# Altium project FrequencyMeter.PrjPcb
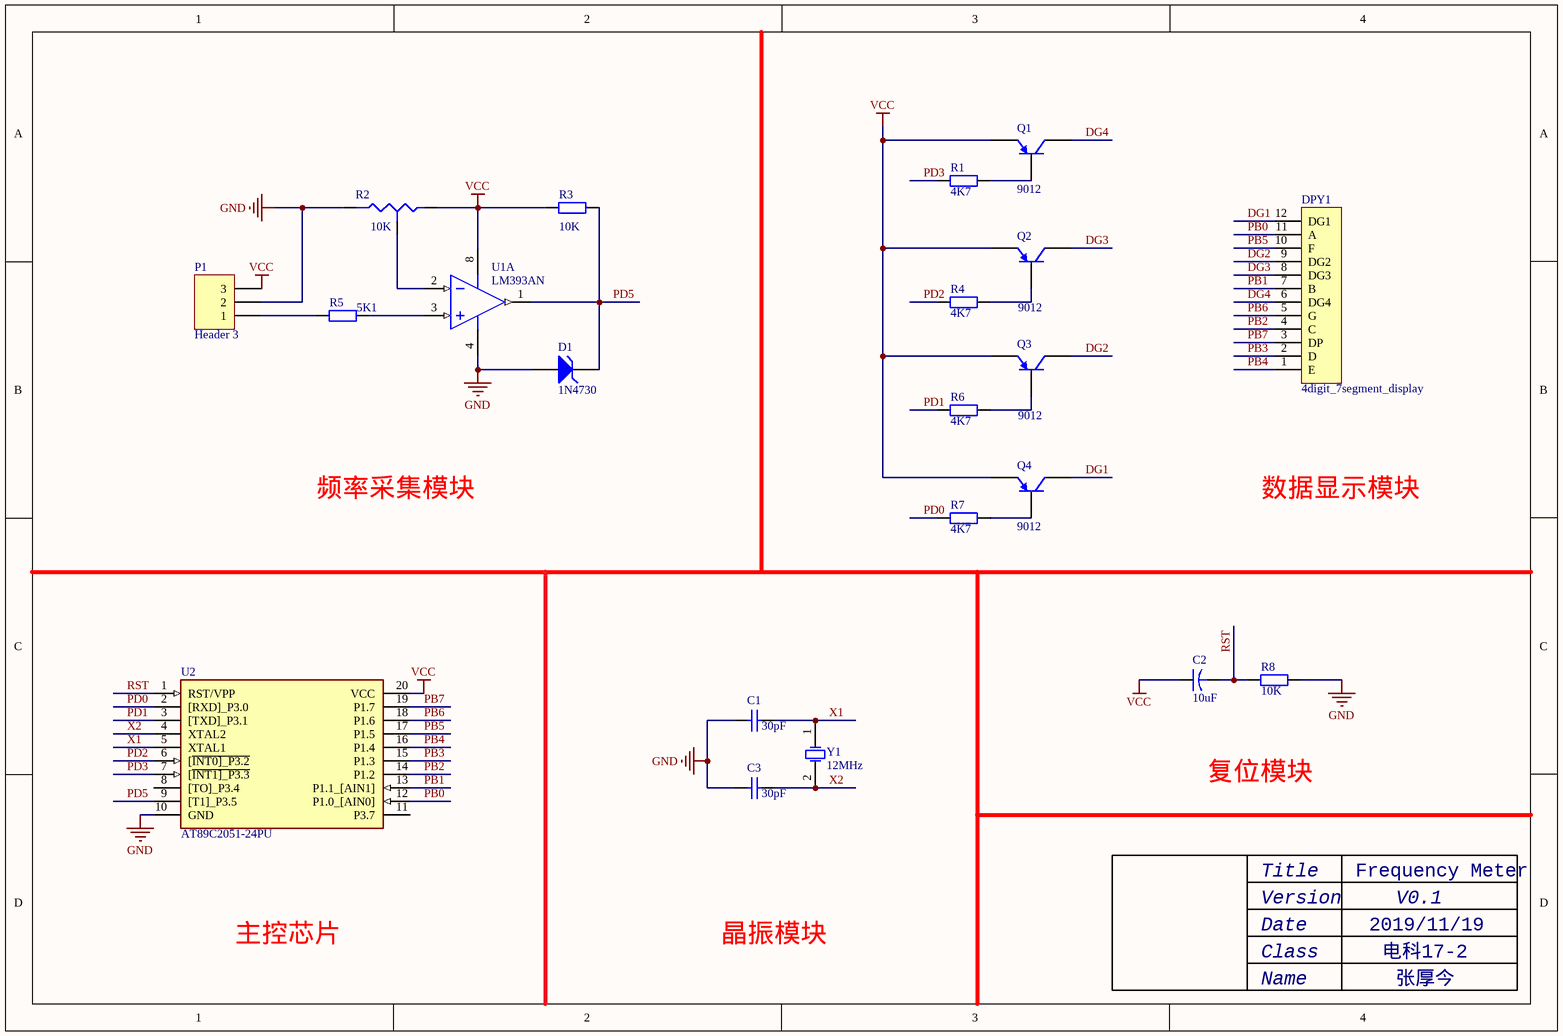
[diagram p0: FrequencyMeter.SchDoc]
1 sheet, 21 parts. Net scope: global (net labels, ports and power ports of the same name join across sheets).
Board file: FrequencyMeter.PcbDoc

## Sheet FrequencyMeter.SchDoc: Frequency Meter
size A4; Date: 2019/11/19; DrawnBy: 张厚今; Revision: V0.1; 班级: 电科17-2

### Parts
C1  value 30pF  [RAD-0.1]  (hidden comment: Cap)
C2  value 10uF  [CAPR5-4X5]  (hidden comment: Cap2)
C3  value 30pF  [RAD-0.1]  (hidden comment: Cap)
D1  1N4730  [DIODE-0.4]
DPY1  4digit_7segment_display  [4digit_7segment_display]
P1  Header 3  [HDR1X3]
Q1  9012  [TO-226-AA]
Q2  9012  [TO-226-AA]
Q3  9012  [TO-226-AA]
Q4  9012  [TO-226-AA]
R1  value 4K7  [AXIAL-0.4]  (hidden comment: Res2)
R2  value 10K  [VR5]  (hidden comment: Res Tap)
R3  value 10K  [AXIAL-0.4]  (hidden comment: Res2)
R4  value 4K7  [AXIAL-0.4]  (hidden comment: Res2)
R5  value 5K1  [AXIAL-0.4]  (hidden comment: Res2)
R6  value 4K7  [AXIAL-0.4]  (hidden comment: Res2)
R7  value 4K7  [AXIAL-0.4]  (hidden comment: Res2)
R8  value 10K  [AXIAL-0.4]  (hidden comment: Res2)
U1  LM393AN  [626-05]  (part A of 2)
U2  AT89C2051-24PU  [DIP794W56P254L2591H533Q20N]
Y1  12MHz  [R38]

### Nets
GND: C1.2 C3.2 D1.1(A) P1.2 R2.2(B) R8.1 U1.4(GND) U2.10(GND)
VCC: C2.1 P1.3 Q1.3(E) Q2.3(E) Q3.3(E) Q4.3(E) R2.1(A) R3.1 U1.8(V+) U2.20(VCC)
DG1: DPY1.12(DG1) Q4.1(C)
DG2: DPY1.9(DG2) Q3.1(C)
DG3: DPY1.8(DG3) Q2.1(C)
DG4: DPY1.6(DG4) Q1.1(C)
PB0: DPY1.11(A) U2.12(P1.0_[AIN0])
PB1: DPY1.7(B) U2.13(P1.1_[AIN1])
PB2: DPY1.4(C) U2.14(P1.2)
PB3: DPY1.2(D) U2.15(P1.3)
PB4: DPY1.1(E) U2.16(P1.4)
PB5: DPY1.10(F) U2.17(P1.5)
PB6: DPY1.5(G) U2.18(P1.6)
PB7: DPY1.3(DP) U2.19(P1.7)
PD0: R7.1 U2.2([RXD]_P3.0)
PD1: R6.1 U2.3([TXD]_P3.1)
PD2: R4.1 U2.6([~{INT0]_P3.2})
PD3: R1.1 U2.7([~{INT1]_P3.3})
PD5: D1.2(K) R3.2 U1.1(OUT) U2.9([T1]_P3.5)
RST: C2.2 R8.2 U2.1(RST/VPP)
X1: C1.1 U2.5(XTAL1) Y1.1(OSC1)
X2: C3.1 U2.4(XTAL2) Y1.2(OSC2)
NetP1_1: P1.1 R5.1
NetQ1_2: Q1.2(B) R1.2
NetQ2_2: Q2.2(B) R4.2
NetQ3_2: Q3.2(B) R6.2
NetQ4_2: Q4.2(B) R7.2
NetR2_3: R2.3(TAP) U1.2(IN-)
NetR5_2: R5.2 U1.3(IN+)

Not connected (* = marked no-connect by the designer): U2 8([TO]_P3.4) 11(P3.7)

### Notes on the sheet
- 频率采集模块
- 数据显示模块
- 复位模块
- Title
- Version
- 主控芯片
- 晶振模块
- Date
- Class
- Name

### Library data of the parts
C1 C3 = Cap: Capacitor; Published: 8-Jun-2000; LatestRevisionDate: 17-Jul-2002; LatestRevisionNote: Re-released for DXP Platform.; PackageReference: RAD-0.3; Publisher: Altium Limited; PackageDescription: Radial Cap, Thru-Hole; 2 Leads; 0.3 in Pin Spacing
C2 = Cap2: Capacitor; Published: 23-Sep-2002; PackageReference: CAPR5-4X5; Publisher: Altium Limited; PackageDescription: Capacitor; 2 Leads
D1 = D Zener: Zener Diode; Published: 8-Jun-2000; LatestRevisionDate: 17-Jul-2002; LatestRevisionNote: Re-released for DXP Platform.; PackageReference: DIODE-0.7; Publisher: Altium Limited; PackageDescription: Diode, Thru-Hole; 2 Leads; 0.7 in Pin Spacing
P1 = Header 3: Header, 3-Pin; LatestRevisionDate: 17-Jul-2002; LatestRevisionNote: Re-released for DXP Platform.; Publisher: Altium Limited
Q1-Q4 = PNP: PNP Bipolar Transistor; Published: 8-Jun-2000; LatestRevisionDate: 29-May-2009; LatestRevisionNote: IPC-7351 Footprint Added.; PackageVersion: Aug-1999; PackageReference: SOT-23B; Publisher: Altium Limited; PackageDescription: 3-Pin SOT-23 Package 0.95 mm Pitch, 2.4 mm Lead Span
R1 R3-R8 = Res2: Resistor; Published: 8-Jun-2000; LatestRevisionDate: 17-Jul-2002; LatestRevisionNote: Re-released for DXP Platform.; PackageReference: AXIAL-0.4; Publisher: Altium Limited; PackageDescription: Axial Device, Thru-Hole; 2 Leads; 0.4 in Pin Spacing
R2 = Res Tap: Tapped Resistor; Sim Note: Enter the Resistance value and the set point into parameter fields.; Set Position: 0.5; Published: 24-Mar-1999; LatestRevisionDate: 17-Jul-2002; LatestRevisionNote: Re-released for DXP Platform.; PackageReference: VR3; Publisher: Altium Limited; PackageDescription: Variable Resistor, Thru-Hole; 3 Leads
U1 = LM393AN: Dual Comparator; Published: 17-Jul-2002; LatestRevisionDate: 06-Jun-2005; LatestRevisionNote: Stylized 3D Model Added.; DatasheetVersion: 1988; PackageReference: 626-05; Publisher: Altium Limited; PackageDescription: DIP; 8 Leads; Row Spacing 7.62 mm; Pitch 2.54 mm; ComponentLink1Description: Manufacturer Link; ComponentLink1URL: http://www.onsemi.com/site/products/taxonomy/0,4438,133,00.html
U2 = AT89C2051-24PU: Integrated Circuit; Manufacturer_Name: Microchip; Datasheet Link: https://componentsearchengine.com/Datasheets/1/AT89C2051-24PU.pdf; Height: 5.334mm; Mouser Part Number: 556-A89C2051-24PU; Mouser Price/Stock: https://www.mouser.com/Search/Refine.aspx?Keyword=556-A89C2051-24PU; Manufacturer_Part_Number: AT89C2051-24PU
Y1 = XTAL: Crystal Oscillator; Published: 8-Jun-2000; LatestRevisionDate: 17-Jul-2002; LatestRevisionNote: Re-released for DXP Platform.; PackageReference: R38; Publisher: Altium Limited; PackageDescription: Crystal, Thru-Hole; 2 Leads; Body 3.1 x 8.2 mm (Dia.xH)